# EAGLE schematic Sweep (EAGLE 7.6.0)
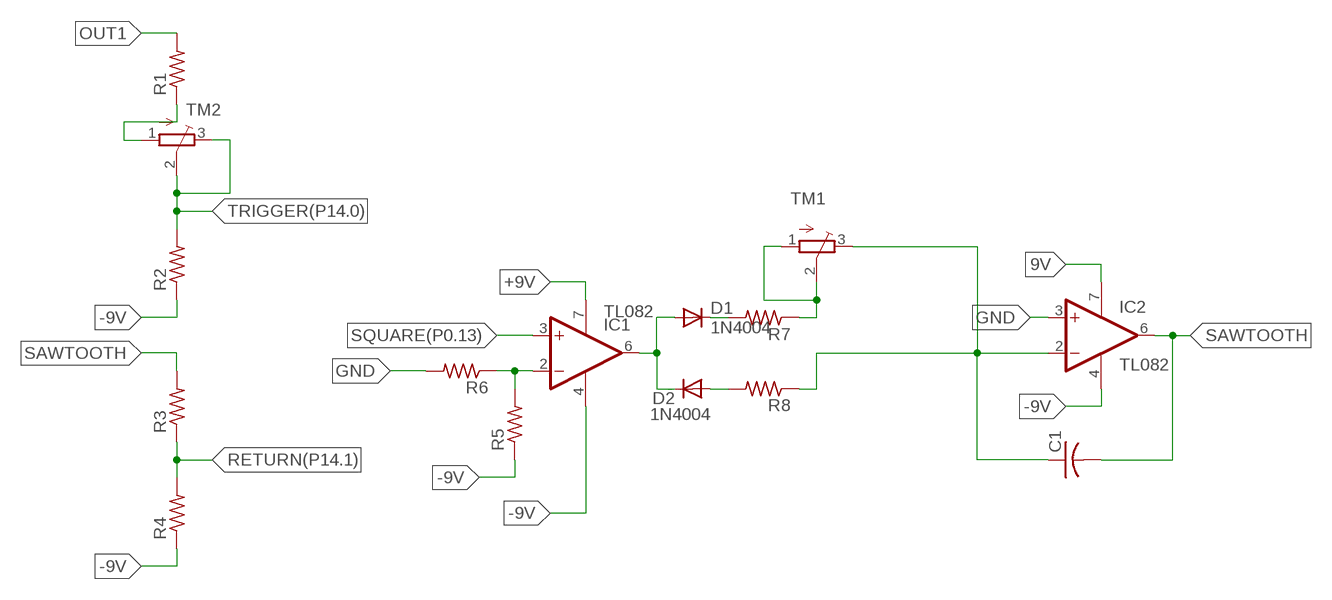
[diagram p0: schematic, sheet 1]

## Parts
C1  C-US025-024X044  [C025-024X044]
D1  1N4004  [DO41-10]
D2  1N4004  [DO41-10]
IC1  TL082  OPA333D  [SO08]
IC2  TL082  OPA333D  [SO08]
R1  R-US_0204/2V  [0204V]
R2  R-US_0204/2V  [0204V]
R3  R-US_0204/2V  [0204V]
R4  R-US_0204/2V  [0204V]
R5  R-US_0204/2V  [0204V]
R6  R-US_0204/2V  [0204V]
R7  R-US_0204/2V  [0204V]
R8  R-US_0204/2V  [0204V]
TM1  TRIMPOT3386  [TRIM-3386]
TM2  TRIMPOT3386  [TRIM-3386]

## Nets
9V: IC2.7(V+)
+9V: IC1.7(V+)
-9V: IC1.4(V-) IC2.4(V-) R2.1 R4.1 R5.1
GND: IC2.3(+IN) R6.2
HOLD(P3.15): R7.1 TM1.1(A) TM1.2(S)
N$1: IC1.2(-IN) R5.2 R6.1
N$2: D1.C R7.2
N$3: D2.A R8.2
N$4: R1.1 TM2.1(A)
N$7: C1.1 IC2.2(-IN) R8.1 TM1.3(E)
OUT1: R1.2
RETURN(P14.1): R3.1 R4.2
SAWTOOTH: C1.2 IC2.6(OUT) R3.2
SQUARE(P0.13): IC1.3(+IN)
TO_INTEGRATOR: D1.A D2.C IC1.6(OUT)
TRIGGER(P14.0): R2.2 TM2.2(S) TM2.3(E)

## Library data of the parts
C1 = adafruit:C-US: CAPACITOR, American symbol
D1 D2 = adafruit:1N4004: DIODE General purpose 1N400x type rectifier (With bigger pads) http://www.ladyada.net/library/pcb/eaglelibrary.html
IC1 IC2 = linear:OPA333: 1.8V, microPOWER CMOS OPERATIONAL AMPLIFIERS Zerø-Drift Series Source: Texas Instruments (Burr-Brown) .. U11 opa333 Operational Amp.pdf
R1-R8 = adafruit:R-US_: RESISTOR, American symbol
TM1 TM2 = adafruit:TRIMPOT: SMT trimmer potentiometer part number TC33X http://www.ladyada.net/library/eagle